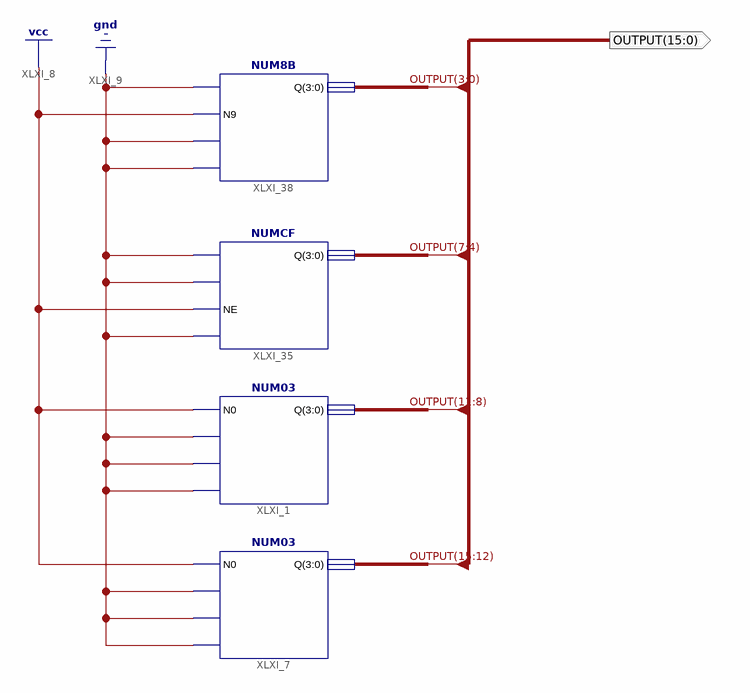
[diagram p0: schematic sheet 1]
// Xilinx ISE schematic BIN_233.sch (spartan6) as structural Verilog: 4 symbols, 1 ports
module BIN_233 (
  output [15:0] OUTPUT
);

  NUM03 XLXI_1 (.N2(1'b0), .N3(1'b0), .N0(1'b1), .N1(1'b0), .Q(OUTPUT[11:8]));
  NUM03 XLXI_7 (.N2(1'b0), .N3(1'b0), .N0(1'b1), .N1(1'b0), .Q(OUTPUT[15:12]));
  NUMCF XLXI_35 (.NE(1'b1), .NF(1'b0), .NC(1'b0), .ND(1'b0), .Q(OUTPUT[7:4]));
  NUM8B XLXI_38 (.NA(1'b0), .NB(1'b0), .N8(1'b0), .N9(1'b1), .Q(OUTPUT[3:0]));
endmodule
